# Altium schematic sheet RELAY.SchDoc
size A4; SheetNumber: 9; SheetTotal: 9
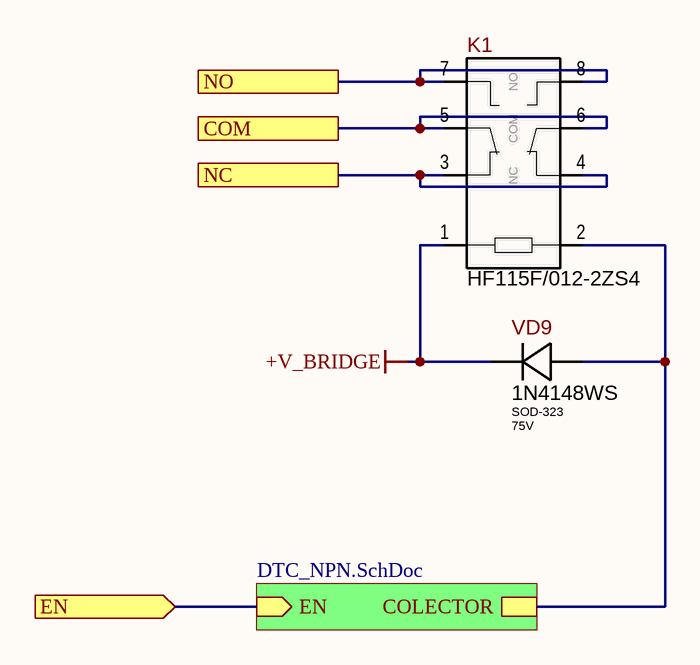
[diagram p0: RELAY.SchDoc]

## Parts
K1  HF115F/012-2ZS4  [HF115Fxxx-1(2)Zx3(4)]
VD9  Package: SOD-323  Voltage: 75V  [SOD-323_MED]  (hidden comment: 1N4148WS)

## Sub-sheets
OC = DTC_NPN.SchDoc: EN (in), COLECTOR

## Ports
COM, EN (in), NC, NO

## Nets
+V_BRIDGE: K1.1(COIL1) VD9.CA
COM: K1.5(1-COM) K1.6(2-COM) ; port COM
EN: port EN, sheet OC/EN
NC: K1.3(1-NC) K1.4(2-NC) ; port NC
NO: K1.7(2-NO) K1.8(2-NO) ; port NO
NetK1_2: K1.2(COIL2) VD9.AN ; sheet OC/COLECTOR

## Notes on the sheet
- Title
- Product:
- Project:
- Size:
- Date:
- Variant:
- A4
- Authors:
- Time:
- Sheet
- of
- Revision:
- @Vitech_ua
- Commit:
- (in symbol HF115F/012-2ZS4) NO; COM; NC

## Library data of the parts
K1 = HF115F/012-2ZS4: Miniature High Power Relay, DPDT (2 Form C), 12VDC 400mW Coil, 5.0mm 2 Pole 8A AgCdO; Manufacturer: Hongfa; Ajax_1C_ID: 38428; Ajax_1C_PN: HF115F/012-2ZS4 HONGFA, Реле; Ajax_1С_Status: RND Only; Component Status: Released; Replacement: NONE; GUID_1C: 4ba44618-64be-11ec-a90c-00505699469b; Part Number: HF115F/012-2ZS4; Part Type: Relay; Component Type: PTH; Temperature Range: -40°C ~ 85°C; ComponentLink1URL: https://www.tme.eu/Document/2962d862af219292e2e76bbc4b5ef3a2/hf115f.pdf; Supplier 1: TME; Supplier Part Number 1: HF115F/012-2ZS4; Price: 2,02140634; ComponentLink1Description: Datasheet
VD9 = 1N4148WS: Diode Standard 75V 150mA, SOD-323F; Manufacturer: Diodec Semiconductor; Ajax_1C_ID: 10255; Ajax_1C_PN: 1N4148WS diotec SOD-323; Ajax_1С_Status: Mass Production; Marking: W2; Component Status: Released; Standard Lead Time: NONE; Vf: 1V @ 50mA; Replacement: 1N4148WS-E; GUID_1C: 3d8ac204-519f-11e7-8106-14dda9d2d04d; Part Type: Fast Switching; Component Type: SMD; Current: 150mA; Temperature Range: -55°C ~ 150°C; ComponentLink1URL: https://diotec.com/tl_files/diotec/files/pdf/datasheets/1n4148ws.pdf; Supplier 1: TME; Supplier Part Number 1: 1N4148WS-DIO; Price: 0,00864; ComponentLink1Description: Datasheet; Part Number: 1N4148WS